# EAGLE design MiniPDB (EAGLE 7.7.0)
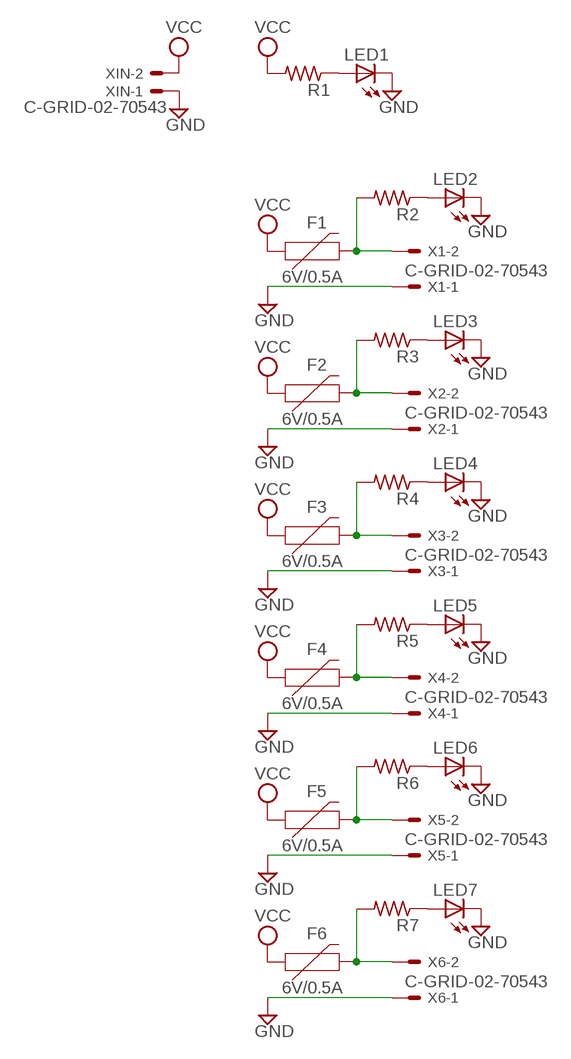
[diagram p0: schematic, sheet 1]

## Parts
F1  6V/0.5A  PPTC_HALF-AMP  [1206]
F2  6V/0.5A  PPTC_HALF-AMP  [1206]
F3  6V/0.5A  PPTC_HALF-AMP  [1206]
F4  6V/0.5A  PPTC_HALF-AMP  [1206]
F5  6V/0.5A  PPTC_HALF-AMP  [1206]
F6  6V/0.5A  PPTC_HALF-AMP  [1206]
LED1  LEDCHIPLED_1206  [CHIPLED_1206]
LED2  LEDCHIPLED_1206  [CHIPLED_1206]
LED3  LEDCHIPLED_1206  [CHIPLED_1206]
LED4  LEDCHIPLED_1206  [CHIPLED_1206]
LED5  LEDCHIPLED_1206  [CHIPLED_1206]
LED6  LEDCHIPLED_1206  [CHIPLED_1206]
LED7  LEDCHIPLED_1206  [CHIPLED_1206]
R1  R-US_R1206  [R1206]
R2  R-US_R1206  [R1206]
R3  R-US_R1206  [R1206]
R4  R-US_R1206  [R1206]
R5  R-US_R1206  [R1206]
R6  R-US_R1206  [R1206]
R7  R-US_R1206  [R1206]
X1  C-GRID-02-70543  [70543-02]
X2  C-GRID-02-70543  [70543-02]
X3  C-GRID-02-70543  [70543-02]
X4  C-GRID-02-70543  [70543-02]
X5  C-GRID-02-70543  [70543-02]
X6  C-GRID-02-70543  [70543-02]
XIN  C-GRID-02-70543  [70543-02]

## Nets
GND: LED1.C LED2.C LED3.C LED4.C LED5.C LED6.C LED7.C X1.1 X2.1 X3.1 X4.1 X5.1 X6.1 XIN.1
N$1: F1.2 R2.2 X1.2
N$2: LED2.A R2.1
N$3: LED1.A R1.1
N$4: F2.2 R3.2 X2.2
N$5: LED3.A R3.1
N$6: F3.2 R4.2 X3.2
N$7: LED4.A R4.1
N$8: F4.2 R5.2 X4.2
N$9: LED5.A R5.1
N$10: F5.2 R6.2 X5.2
N$11: LED6.A R6.1
N$12: F6.2 R7.2 X6.2
N$13: LED7.A R7.1
VCC: F1.1 F2.1 F3.1 F4.1 F5.1 F6.1 R1.2 XIN.2

## Library data of the parts
F1-F6 = SparkFun-Fuses:PPTC: Resettable Fuse PPTC Resettable Fuse. Really a sort of resistor with a polymeric positive temperature coefficient whose resistance increases dramatically with an increase in temperature. When heated by the power passing through the resistance rises causing the current to be limited, protecting the circuit. This is achieved by the transition of the polymer from a crystalline to an amorphous state where the conductive carbon separates breaking the conductive pathways found in the cool crystalline structure. When a PPTC cools back down it resumes conducting letting the circuit turn back on. SparkFun Products: SparkFun RedBoard - Programmed with Arduino <https://www.sparkfun.com/products/12757> Pro Micro - 5V/16MHz <https://www.sparkfun.com/products/12640> Arduino Pro 328 - 5V/16MHz <https://www.sparkfun.com/products/10915> MP3 Trigger <https://www.sparkfun.com/products/13720>; PROD_ID: RES-08585
LED1-LED7 = led:LED: LED OSRAM: - CHIPLED LG R971, LG N971, LY N971, LG Q971, LY Q971, LO R971, LY R971 LH N974, LH R974 LS Q976, LO Q976, LY Q976 LO Q996 - Hyper CHIPLED LW Q18S LB Q993, LB Q99A, LB R99A - SideLED LS A670, LO A670, LY A670, LG A670, LP A670 LB A673, LV A673, LT A673, LW A673 LH A674 LY A675 LS A676, LA A676, LO A676, LY A676, LW A676 LS A679, LY A679, LG A679 - Hyper Micro SIDELED® LS Y876, LA Y876, LO Y876, LY Y876 LT Y87S - SmartLED LW L88C, LW L88S LB L89C, LB L89S, LG L890 LS L89K, LO L89K, LY L89K LS L896, LA L896, LO L896, LY L896 - TOPLED LS T670, LO T670, LY T670, LG T670, LP T670 LSG T670, LSP T670, LSY T670, LOP T670, LYG T670 LG T671, LOG T671, LSG T671 LB T673, LV T673, LT T673, LW T673 LH T674 LS T676, LA T676, LO T676, LY T676, LB T676, LH T676, LSB T676, LW T676 LB T67C, LV T67C, LT T67C, LS T67K, LO T67K, LY T67K, LW E67C LS E67B, LA E67B, LO E67B, LY E67B, LB E67C, LV E67C, LT E67C LW T67C LS T679, LY T679, LG T679 LS T770, LO T770, LY T770, LG T770, LP T770 LB T773, LV T773, LT T773, LW T773 LH T774 LS E675, LA E675, LY E675, LS T675 LS T776, LA T776, LO T776, LY T776, LB T776 LHGB T686 LT T68C, LB T68C - Hyper Mini TOPLED® LB M676 - Mini TOPLED Santana® LG M470 LS M47K, LO M47K, LY M47K Source: http://www.osram.convergy.de LUXEON: - LUMILED® LXK2-PW12-R00, LXK2-PW12-S00, LXK2-PW14-U00, LXK2-PW14-V00 LXK2-PM12-R00, LXK2-PM12-S00, LXK2-PM14-U00 LXK2-PE12-Q00, LXK2-PE12-R00, LXK2-PE12-S00, LXK2-PE14-T00, LXK2-PE14-U00 LXK2-PB12-K00, LXK2-PB12-L00, LXK2-PB12-M00, LXK2-PB14-N00, LXK2-PB14-P00, LXK2-PB14-Q00 LXK2-PR12-L00, LXK2-PR12-M00, LXK2-PR14-Q00, LXK2-PR14-R00 LXK2-PD12-Q00, LXK2-PD12-R00, LXK2-PD12-S00 LXK2-PH12-R00, LXK2-PH12-S00 LXK2-PL12-P00, LXK2-PL12-Q00, LXK2-PL12-R00 Source: www.luxeon.com KINGBRIGHT: KA-3528ASYC Source: www.kingbright.com
R1-R7 = resistor:R-US_: RESISTOR, American symbol
X1-X6 XIN = con-molex:C-GRID-02: CONNECTOR wire to board 2.54 mm (0.100") pitch header; OC_FARNELL: unknown; OC_NEWARK: unknown

## Board
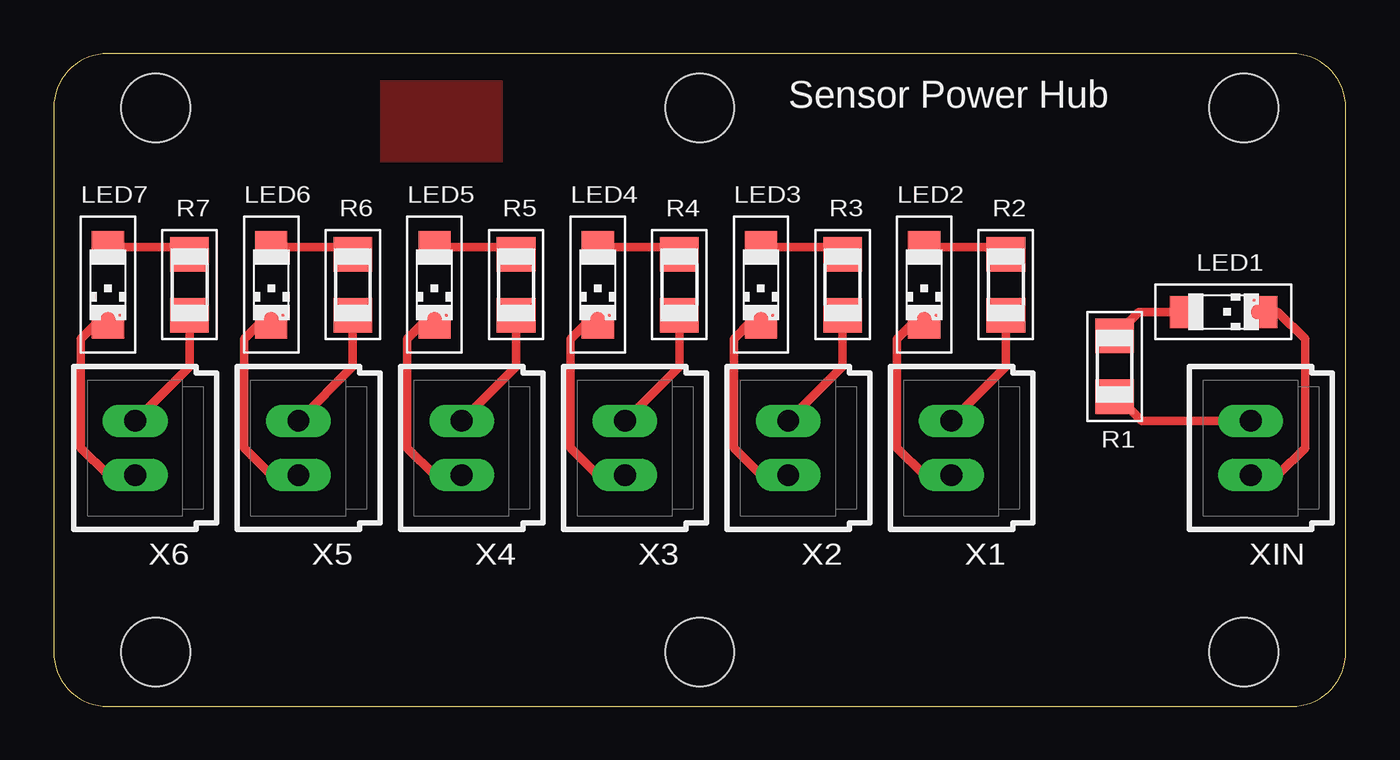
[diagram p1: board, top side]
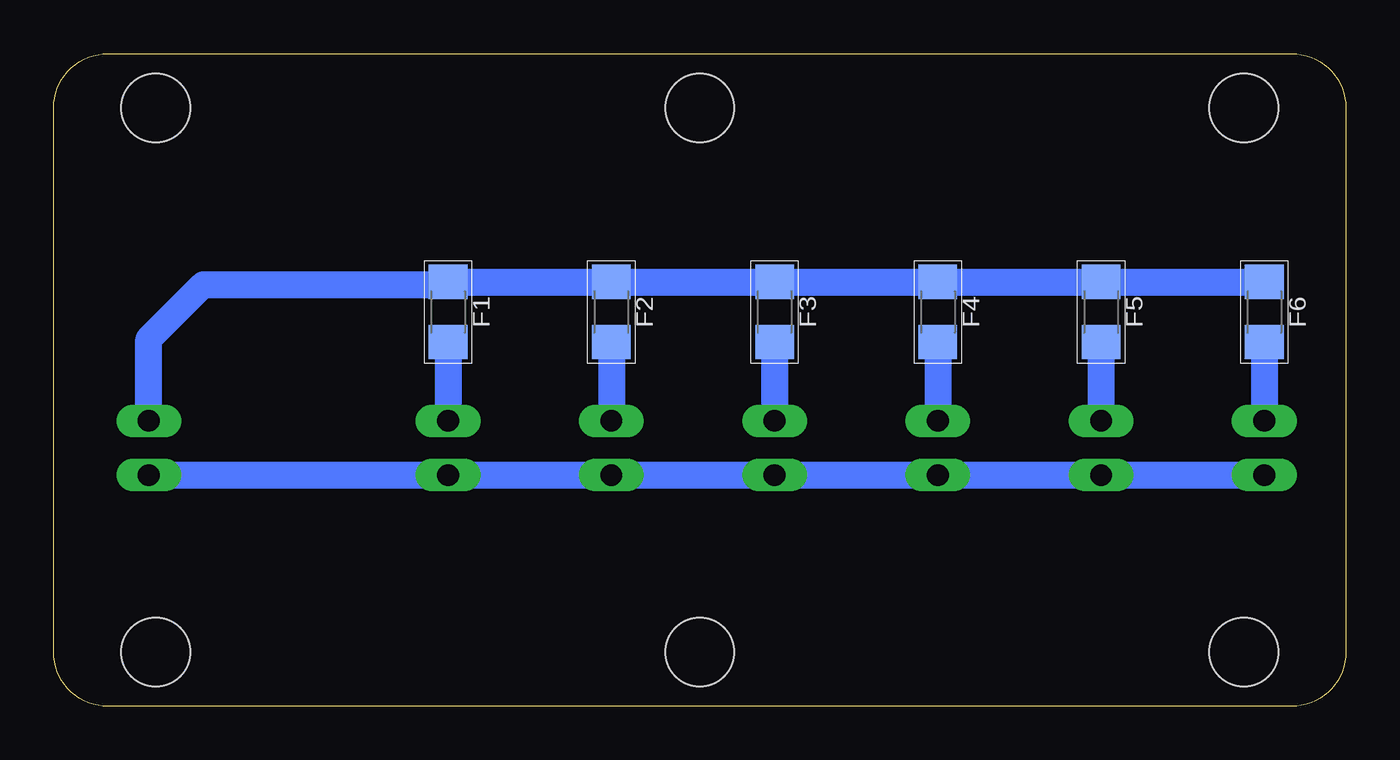
[diagram p2: board, bottom side, seen from below]

Size 60.33 x 30.48 mm. Coordinates in mm from the lower left corner, seen from the top.
Outline: 2.54,0 57.78,0 arc90 60.33,2.54 60.33,27.94 arc90 57.78,30.48 2.54,30.48 arc90 0,27.94 0,2.54 arc90 2.54,0
Copper layers (1*16): Top 0.035mm / dielectric 1.5mm / Bottom 0.035mm
Design rules "default": minimum track width 10mil, minimum drill 24mil, track to track 8mil, track to pad 8mil, pad to pad 8mil, via to via 8mil, smd to smd 8mil, copper to edge 40mil, drill to drill 8mil, minimum pad ring 10mil, minimum via ring 8mil, stop-mask expansion 4mil, vias tented up to drill 0mil, thermal gap 10mil
Holes 3.2 mm at 4.76,2.54 4.76,27.94 55.56,2.54 55.56,27.94 30.16,27.94 30.16,2.54

### Footprints (pad centres in the part's own frame; a part is rotated, then mirrored left to right if it is on the bottom)
1206 = smd 1.6 x 1.8: 1 -1.4,0; 2 1.4,0
CHIPLED_1206 = smd 1.5 x 1.5: A 0,-1.75; C 0,1.75
R1206 = smd 1.6 x 1.803: 1 -1.422,0; 2 1.422,0
70543-02 = drill 1.016 long: 1 -1.27,0; 2 1.27,0

### Placement (x,y rotation side)
F1  41.91,18.41 270 bottom
F2  34.29,18.41 270 bottom
F3  26.67,18.41 270 bottom
F4  19.05,18.41 270 bottom
F5  11.43,18.41 270 bottom
F6  3.81,18.41 270 bottom
LED1  54.61,18.41 270 top
LED2  40.64,19.68 180 top
LED3  33.02,19.68 180 top
LED4  25.4,19.68 180 top
LED5  17.78,19.68 180 top
LED6  10.16,19.68 180 top
LED7  2.54,19.68 180 top
R1  49.53,15.88 270 top
R2  44.45,19.68 270 top
R3  36.83,19.68 270 top
R4  29.21,19.68 270 top
R5  21.59,19.68 270 top
R6  13.97,19.68 270 top
R7  6.35,19.68 270 top
X1  41.91,12.06 90 top
X2  34.29,12.06 90 top
X3  26.67,12.06 90 top
X4  19.05,12.06 90 top
X5  11.43,12.06 90 top
X6  3.81,12.06 90 top
XIN  55.88,12.06 90 top

### Tracks (layer width: path | path; a pad name or v marks a point on that pad's centre or on a via)
GND
  Top 0.406: LED1.C 57.15,18.41 58.42,17.14 58.42,12.06 57.15,10.79 XIN.1 | LED2.C 40.16,17.93 39.37,17.14 39.37,12.06 40.64,10.79 X1.1 | LED3.C 32.54,17.93 31.75,17.14 31.75,12.06 33.02,10.79 X2.1 | LED4.C 24.92,17.93 24.13,17.14 24.13,12.06 25.4,10.79 X3.1 | LED5.C 17.3,17.93 16.51,17.14 16.51,12.06 17.78,10.79 X4.1 | LED6.C 9.68,17.93 8.89,17.14 8.89,12.06 10.16,10.79 X5.1 | LED7.C 2.06,17.93 1.27,17.14 1.27,12.06 2.54,10.79 X6.1
  Bottom 1.27: XIN.1 X1.1 X2.1 X3.1 X4.1 X5.1 X6.1
N$1
  Top 0.406: R2.2 44.45,15.88 X1.2
  Bottom 1.27: F1.2 X1.2
N$2
  Top 0.406: LED2.A 43.49,21.43 R2.1
N$3
  Top 0.406: LED1.A 50.65,18.41 R1.1
N$4
  Top 0.406: R3.2 36.83,15.88 X2.2
  Bottom 1.27: F2.2 X2.2
N$5
  Top 0.406: LED3.A 36.5,21.43 R3.1
N$6
  Top 0.406: R4.2 29.21,15.88 X3.2
  Bottom 1.27: F3.2 X3.2
N$7
  Top 0.406: LED4.A 28.88,21.43 R4.1
N$8
  Top 0.406: R5.2 21.59,15.88 X4.2
  Bottom 1.27: F4.2 X4.2
N$9
  Top 0.406: LED5.A 21.26,21.43 R5.1
N$10
  Top 0.406: R6.2 13.97,15.88 X5.2
  Bottom 1.27: F5.2 X5.2
N$11
  Top 0.406: LED6.A 13.64,21.43 R6.1
N$12
  Top 0.406: R7.2 6.35,15.88 X6.2
  Bottom 1.27: F6.2 X6.2
N$13
  Top 0.406: LED7.A 6.02,21.43 R7.1
N$14
  pour Top: 15.24,29.21 20.95,29.21 20.95,25.4 15.24,25.4
VCC
  Top 0.406: R1.2 49.68,14.45 50.8,13.34 XIN.2
  Bottom 1.27: XIN.2 55.88,17.14 53.34,19.68 42.04,19.68 F1.1 F2.1 F3.1 F4.1 F5.1 F6.1

### Text on the board
tPlace: Sensor Power Hub